# Altium project Peripheral Board.PrjPcb
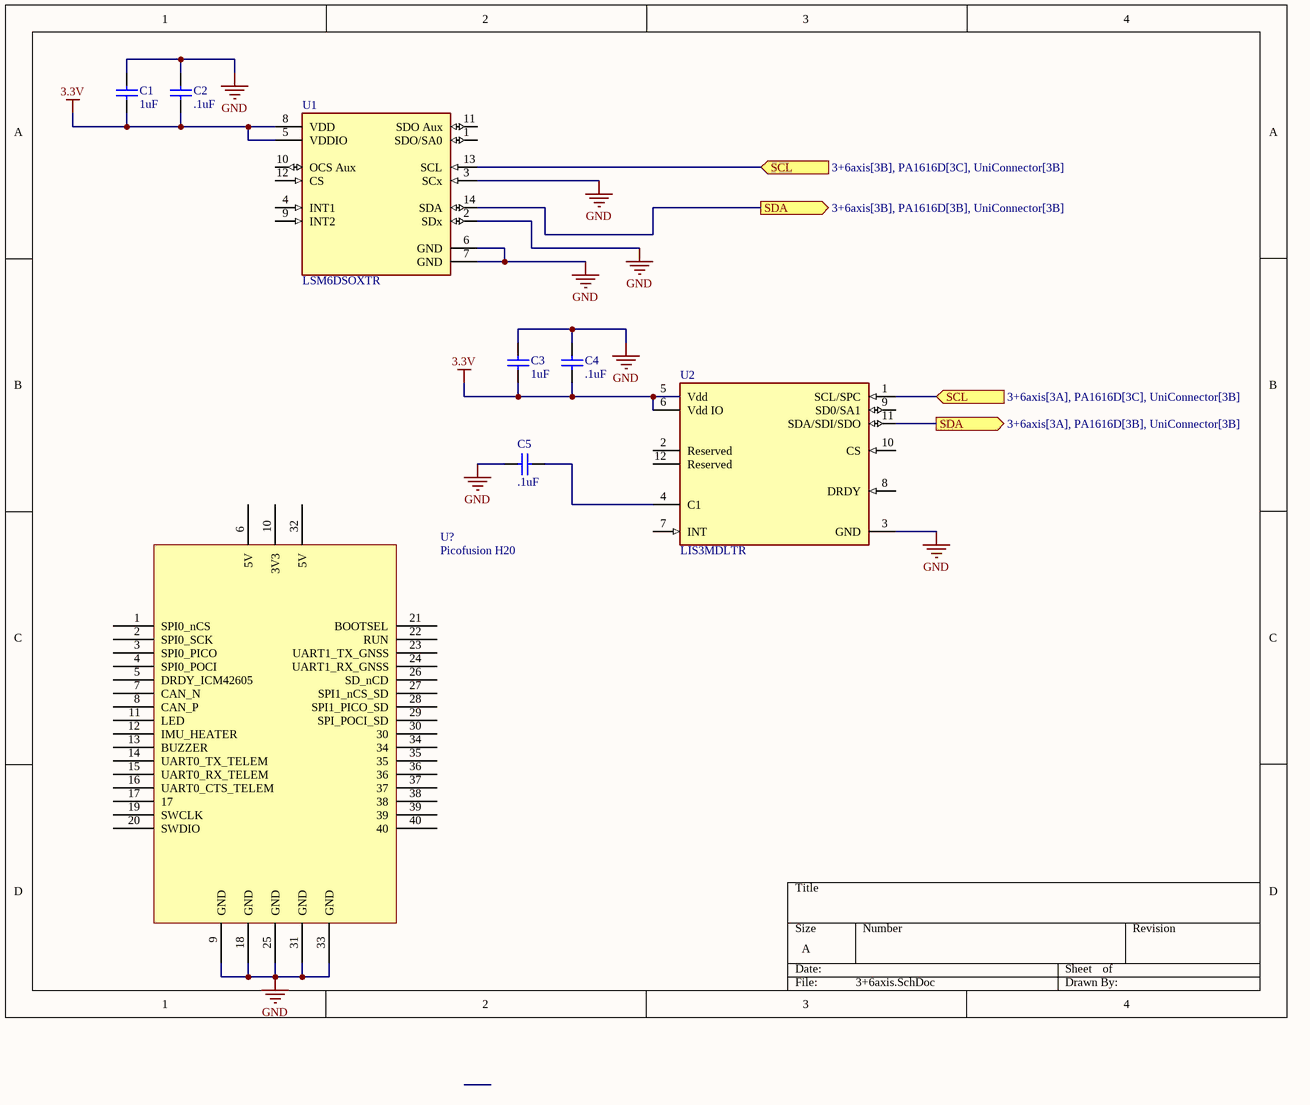
[diagram p0: 3+6axis.SchDoc]
5 sheets, 20 parts. Net scope: flat (ports and power ports of the same name join across sheets).
Board file: Peripheralboard2.PcbDoc
Sheets:
  3+6axis.SchDoc
  CurrentSensor.SchDoc
  Amplifier.SchDoc
  PA1616D.SchDoc
  UniConnector.SchDoc

## Sheet 3+6axis.SchDoc
size A; SheetNumber: 1; SheetTotal: 5

### Parts
C1  1uF  [CAPC2013X145X48ML20T23]
C2  .1uF  [CAPC2013X145X48ML20T23]
C3  1uF  [CAPC2013X145X48ML20T23]
C4  .1uF  [CAPC2013X145X48ML20T23]
C5  .1uF  [CAPC2013X145X48ML20T23]
U1  LSM6DSOXTR  [FP-LGA-14L-DM00249496-MFG]
U2  LIS3MDLTR  [FP-VFLGA-12-8365767-MFG]
U?  Picofusion H20  [PicoFusion H Series]

### Ports
SCL (in, see 3+6axis[3A], PA1616D[3C], UniConnector[3B]), SCL (in, see 3+6axis[3B], PA1616D[3C], UniConnector[3B]), SDA (out, see 3+6axis[3A], PA1616D[3B], UniConnector[3B]), SDA (out, see 3+6axis[3B], PA1616D[3B], UniConnector[3B])

### Nets
3.3V: C1.1 C2.1 C3.1 C4.1 U1.5(VDDIO) U1.8(VDD) U2.5(Vdd) U2.6(Vdd_IO)
GND: C1.2 C2.2 C3.2 C4.2 C5.1 U1.2(SDx) U1.3(SCx) U1.6(GND) U1.7(GND) U2.3(GND) U?.9(GND) U?.18(GND) U?.25(GND) U?.31(GND) U?.33(GND)
NetC5_2: C5.2 U2.4(C1)
NetJ1_D1: U1.14(SDA) U2.11(SDA/SDI/SDO) ; port SDA
NetJ1_D2: U1.13(SCL) U2.1(SCL/SPC) ; port SCL

Not connected (* = marked no-connect by the designer): U1 1(SDO/SA0) 4(INT1) 9(INT2) 10(OCS_Aux) 11(SDO_Aux) 12(CS); U2 2(Reserved) 7(INT) 8(DRDY) 9(SD0/SA1) 10(CS) 12(Reserved); U? 1(SPI0_nCS) 2(SPI0_SCK) 3(SPI0_PICO) 4(SPI0_POCI) 5(DRDY_ICM42605) 6(5V) 7(CAN_N) 8(CAN_P) 10(3V3) 11(LED) 12(IMU_HEATER) 13(BUZZER) 14(UART0_TX_TELEM) 15(UART0_RX_TELEM) 16(UART0_CTS_TELEM) 17 19(SWCLK) 20(SWDIO) 21(BOOTSEL) 22(RUN) 23(UART1_TX_GNSS) 24(UART1_RX_GNSS) 26(SD_nCD) 27(SPI1_nCS_SD) 28(SPI1_PICO_SD) 29(SPI_POCI_SD) 30 32(5V) 34 35 36 37 38 39 40

### Library data of the parts
C1-C5 = CMP-2007-03160-1: Part Number: VJ0805Y103KXBBC31; Manufacturer: Vitramon
U1 = CMP-12177-000010-1: INEMO INERTIAL MODULE: 3D ACCELE; Manufacturer: STMicroelectronics; Sensor Type: Temperature,Accelerometer,Gyroscope; Accel Range: 2/4/8/16g; Accel Sensitivity: 0.061/0.122/0.244/0.488mV/g; Operating Supply Current: 0.55mA; Gyro Range: 125/250/500/1000/2000°/s; Gyro Sensitivity: 4.375/8.75/17.5/35/70LSB/°/s; Sensor Output: I2C,SPI,Other; Min Supply Voltage: 1.62V; Max Supply Voltage: 3.6V; Octopart: https://octopart.com/lsm6dsoxtr-stmicroelectronics-98102600; Package: LGA-14L-DM00249496; Footprint Url: https://www.st.com/content/ccc/resource/technical/document/technical_note/73/17/9c/16/dd/96/4a/01/CD00134799.pdf/files/CD00134799.pdf/jcr:content/translations/en.CD00134799.pdf; ComponentLink2Description: Datasheet; Mouser Description: LSM6DSOX: 3.6 V 3 Axis Accelerometer Gyroscope iNEMO Inertial Module - LGA-14L; ComponentLink2URL: https://www.st.com/resource/en/datasheet/lsm6dsox.pdf; Temperature Range Low: -40°C; Digikey Description: INEMO INERTIAL MODULE: 3D ACCELE; Lead Free: Yes; Device Class L3: Inertial Measurement Units (IMUs); Category: IC; Device Class L2: Motion Sensors; RoHS: TRUE; Temperature: -40°C to +85°C; Height: 0.86mm; Device Class L1: Sensors; Temperature Range High: +85°C; Manufacturer Part Number: LSM6DSOXTR; Automotive: No
U2 = CMP-2000-07463-2: SENSOR MR I2C/SPI 12LGA; Manufacturer: STMicroelectronics; Sensor Output: I2C,SPI; Operating Supply Current: 40-270uA; Max Supply Voltage: 3.6V; Sensing Method: Magnetic; Min Supply Voltage: 1.71V; ComponentLink2URL: https://www.st.com/resource/en/datasheet/lis3mdl.pdf; Category: IC; Manufacturer Part Number: LIS3MDLTR; Octopart: https://octopart.com/lis3mdltr-stmicroelectronics-29403125; Automotive: No; ComponentLink2Description: Datasheet; RoHS: TRUE; Device Class L3: unset; Device Class L1: Sensors; Temperature: -40°C to +85°C; Height: 1mm; Mouser Description: Board Mount Hall Effect / Magnetic Sensors Ultra Lo-Pwr Hi Perf 3-Axis 1.9-3.6V; Temperature Range High: +85°C; Lead Free: Yes; Device Class L2: Magnetic Sensors; Footprint Url: https://www.st.com/content/ccc/resource/technical/document/technical_note/73/17/9c/16/dd/96/4a/01/CD00134799.pdf/files/CD00134799.pdf/jcr:content/translations/en.CD00134799.pdf; Temperature Range Low: -40°C; Package: VFLGA-12-8365767; Digikey Description: SENSOR MR I2C/SPI 12LGA

## Sheet CurrentSensor.SchDoc
size A; SheetNumber: 2; SheetTotal: 5
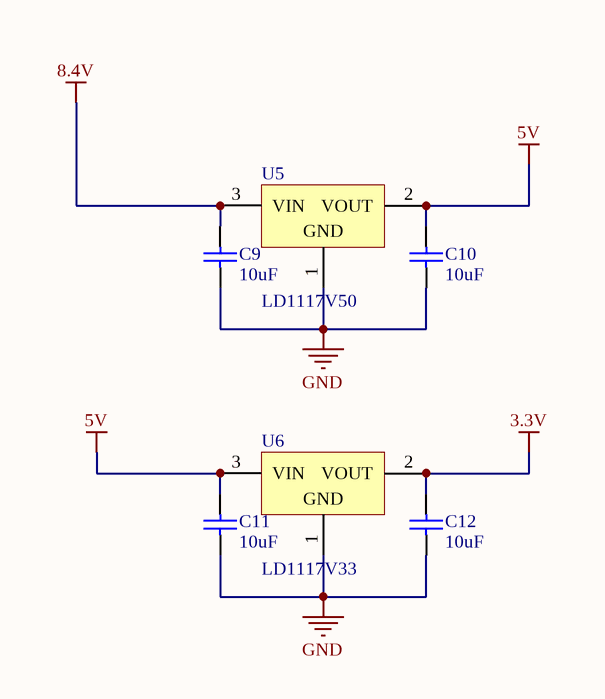
[diagram p1: CurrentSensor.SchDoc]

### Parts
C9  10uF  [CAPC2013X145X48ML20T23]
C10  10uF  [CAPC2013X145X48ML20T23]
C11  10uF  [CAPC2013X145X48ML20T23]
C12  10uF  [CAPC2013X145X48ML20T23]
U5  LD1117V50  [TO220]
U6  LD1117V33  [TO220]

### Nets
3.3V: C12.1 U6.2(VOUT)
5V: C10.1 C11.1 U5.2(VOUT) U6.3(VIN)
8.4V: C9.1 U5.3(VIN)
GND: C9.2 C10.2 C11.2 C12.2 U5.1(GND) U6.1(GND)

### Library data of the parts
C9-C12 = CMP-2007-03160-1: as C1 on sheet 3+6axis
U5 = CMP-0244-00472-1: Fixed Low Drop Positive Voltage Regulator, 5V, 3-Pin TO-220; ComponentLink1URL: http://www.st.com; ComponentLink1Description: Manufacturer URL; DatasheetVersion: 1/11/2011; PackageDescription: TO, Thru-Hole, Vertical, Heatsink Mounted; 3 In-Line Leads; Pitch 2.54 mm; ComponentLink2Description: Datasheet; ComponentLink3URL: http://www.st.com/internet/com/TECHNICAL_RESOURCES/TECHNICAL_LITERATURE/PACKAGE_INFORMATION/CD00004649.pdf; PackageVersion: ver3.0; PackageReference: TO220; ComponentLink2URL: http://www.st.com/internet/com/TECHNICAL_RESOURCES/TECHNICAL_LITERATURE/DATASHEET/CD00000544.pdf; ComponentLink3Description: Package Specification
U6 = CMP-0244-00470-1: Fixed Low Drop Positive Voltage Regulator, 3.3V, 3-Pin TO-220; PackageVersion: ver3.0; PackageDescription: TO, Thru-Hole, Vertical, Heatsink Mounted; 3 In-Line Leads; Pitch 2.54 mm; ComponentLink1Description: Manufacturer URL; ComponentLink3URL: http://www.st.com/internet/com/TECHNICAL_RESOURCES/TECHNICAL_LITERATURE/PACKAGE_INFORMATION/CD00004649.pdf; PackageReference: TO220; ComponentLink2URL: http://www.st.com/internet/com/TECHNICAL_RESOURCES/TECHNICAL_LITERATURE/DATASHEET/CD00000544.pdf; ComponentLink3Description: Package Specification; ComponentLink2Description: Datasheet; ComponentLink1URL: http://www.st.com; DatasheetVersion: 1/11/2011

## Sheet Amplifier.SchDoc
size A; SheetNumber: 3; SheetTotal: 5
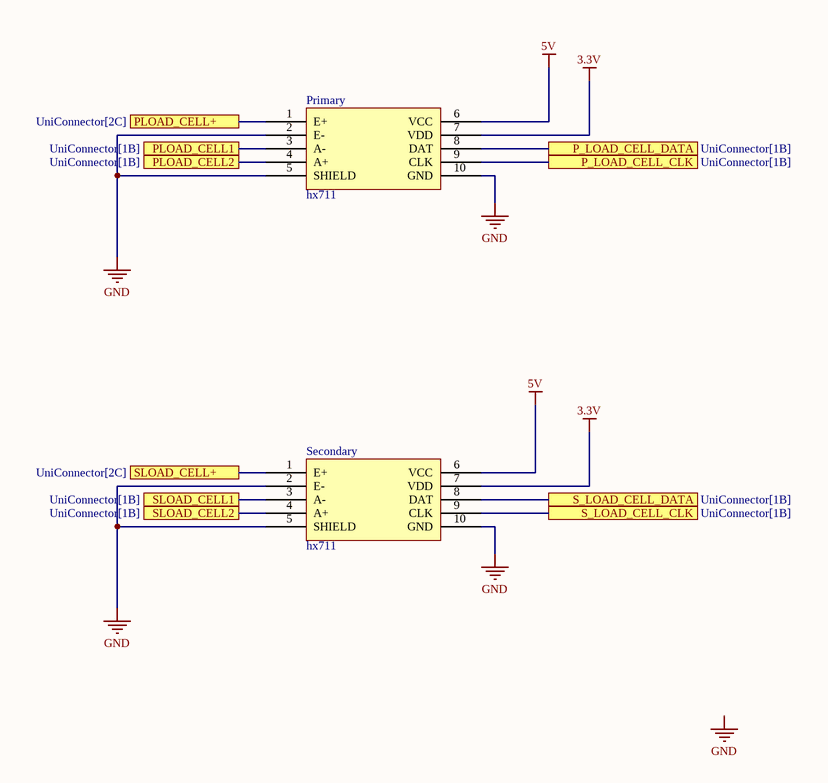
[diagram p2: Amplifier.SchDoc]

### Parts
Primary  hx711  [PCBComponent_1]
Secondary  hx711  [PCBComponent_1]

### Ports
P_LOAD_CELL_CLK (see UniConnector[1B]), P_LOAD_CELL_DATA (see UniConnector[1B]), PLOAD_CELL1 (see UniConnector[1B]), PLOAD_CELL2 (see UniConnector[1B]), PLOAD_CELL+ (see UniConnector[2C]), S_LOAD_CELL_CLK (see UniConnector[1B]), S_LOAD_CELL_DATA (see UniConnector[1B]), SLOAD_CELL1 (see UniConnector[1B]), SLOAD_CELL2 (see UniConnector[1B]), SLOAD_CELL+ (see UniConnector[2C])

### Nets
3.3V: Primary.7(VDD) Secondary.7(VDD)
5V: Primary.6(VCC) Secondary.6(VCC)
GND: Primary.2(E-) Primary.5(SHIELD) Primary.10(GND) Secondary.2(E-) Secondary.5(SHIELD) Secondary.10(GND)
P_LOAD_CELL_CLK: Primary.9(CLK) ; port P_LOAD_CELL_CLK
P_LOAD_CELL_DATA: Primary.8(DAT) ; port P_LOAD_CELL_DATA
S_LOAD_CELL_CLK: Secondary.9(CLK) ; port S_LOAD_CELL_CLK
S_LOAD_CELL_DATA: Secondary.8(DAT) ; port S_LOAD_CELL_DATA
NetJ1_B3: Secondary.3(A-) ; port SLOAD_CELL1
NetJ1_B4: Secondary.4(A+) ; port SLOAD_CELL2
NetJ1_B5: Primary.3(A-) ; port PLOAD_CELL1
NetJ1_B6: Primary.4(A+) ; port PLOAD_CELL2
NetJ1_C4: Primary.1(E+) ; port PLOAD_CELL+
NetJ1_C5: Secondary.1(E+) ; port SLOAD_CELL+

### Notes on the sheet
- Labels drawn without touching a wire or pin: GND

### Library data of the parts
Primary Secondary = Component_1

## Sheet PA1616D.SchDoc
size A; SheetNumber: 4; SheetTotal: 5
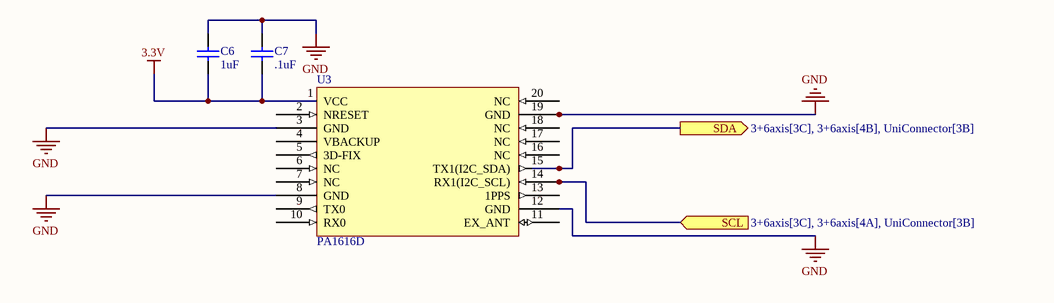
[diagram p3: PA1616D.SchDoc]

### Parts
C6  1uF  [CAPC2013X145X48ML20T23]
C7  .1uF  [CAPC2013X145X48ML20T23]
U3  PA1616D  [PA1616D]

### Ports
SCL (in, see 3+6axis[3C], 3+6axis[4A], UniConnector[3B]), SDA (out, see 3+6axis[3C], 3+6axis[4B], UniConnector[3B])

### Nets
3.3V: C6.1 C7.1 U3.1(VCC)
GND: C6.2 C7.2 U3.3(GND) U3.12(GND) U3.19(GND)
NetJ1_D1: U3.15(TX1(I2C_SDA)) ; port SDA
NetJ1_D2: U3.14(RX1(I2C_SCL)) ; port SCL

Not connected (* = marked no-connect by the designer): U3 2(NRESET) 4(VBACKUP) 5(3D-FIX) 6(NC) 7(NC) 8(GND) 9(TX0) 10(RX0) 11(EX_ANT) 13(1PPS) 16(NC) 17(NC) 18(NC) 20(NC)

### Library data of the parts
C6 C7 = CMP-2007-03160-1: as C1 on sheet 3+6axis

## Sheet UniConnector.SchDoc
size A; SheetNumber: 5; SheetTotal: 5
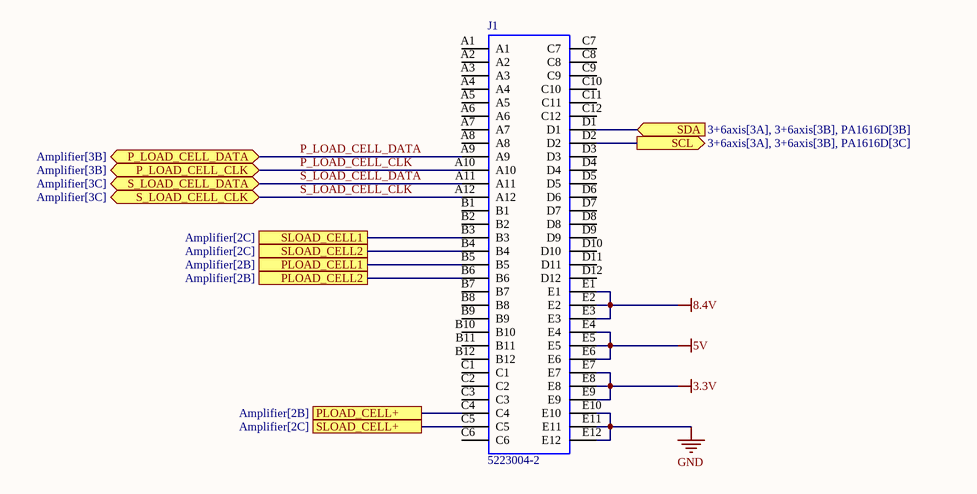
[diagram p4: UniConnector.SchDoc]

### Parts
J1  5223004-2  [52230042]

### Ports
P_LOAD_CELL_CLK (bidir, see Amplifier[3B]), P_LOAD_CELL_DATA (bidir, see Amplifier[3B]), PLOAD_CELL1 (see Amplifier[2B]), PLOAD_CELL2 (see Amplifier[2B]), PLOAD_CELL+ (see Amplifier[2B]), S_LOAD_CELL_CLK (bidir, see Amplifier[3C]), S_LOAD_CELL_DATA (bidir, see Amplifier[3C]), SCL (out, see 3+6axis[3A], 3+6axis[3B], PA1616D[3C]), SDA (in, see 3+6axis[3A], 3+6axis[3B], PA1616D[3B]), SLOAD_CELL1 (see Amplifier[2C]), SLOAD_CELL2 (see Amplifier[2C]), SLOAD_CELL+ (see Amplifier[2C])

### Nets
3.3V: J1.E7 J1.E8 J1.E9
5V: J1.E4 J1.E5 J1.E6
8.4V: J1.E1 J1.E2 J1.E3
GND: J1.E10 J1.E11 J1.E12
P_LOAD_CELL_CLK: J1.A10 ; port P_LOAD_CELL_CLK
P_LOAD_CELL_DATA: J1.A9 ; port P_LOAD_CELL_DATA
S_LOAD_CELL_CLK: J1.A12 ; port S_LOAD_CELL_CLK
S_LOAD_CELL_DATA: J1.A11 ; port S_LOAD_CELL_DATA
NetJ1_B3: J1.B3 ; port SLOAD_CELL1
NetJ1_B4: J1.B4 ; port SLOAD_CELL2
NetJ1_B5: J1.B5 ; port PLOAD_CELL1
NetJ1_B6: J1.B6 ; port PLOAD_CELL2
NetJ1_C4: J1.C4 ; port PLOAD_CELL+
NetJ1_C5: J1.C5 ; port SLOAD_CELL+
NetJ1_D1: J1.D1 ; port SDA
NetJ1_D2: J1.D2 ; port SCL

Not connected (* = marked no-connect by the designer): J1 A1 A2 A3 A4 A5 A6 A7 A8 B1 B2 B7 B8 B9 B10 B11 B12 C1 C2 C3 C6 C7 C8 C9 C10 C11 C12 D3 D4 D5 D6 D7 D8 D9 D10 D11 D12

### Library data of the parts
J1 = 5223004-2: Conn Backplane RCP 60 POS 2mm Solder RA Thru-Hole Tube; Manufacturer_Name: TE Connectivity; Geometry.Height: 14mm; Mouser Part Number: 571-5223004-2; Mouser Price/Stock: https://www.mouser.co.uk/ProductDetail/TE-Connectivity/5223004-2?qs=oNRo%252BTjlpTO6tP0xSX%252BI3w%3D%3D; Manufacturer_Part_Number: 5223004-2; Datasheet Link: https://www.te.com/commerce/DocumentDelivery/DDEController?Action=srchrtrv&DocNm=5223004&DocType=Customer+Drawing&DocLang=English

## Nets that join several sheets
3.3V: 3+6axis (8 pins), CurrentSensor (C12.1 U6.2), Amplifier (Primary.7 Secondary.7), PA1616D (C6.1 C7.1 U3.1), UniConnector (J1.E7 J1.E8 J1.E9)
5V: CurrentSensor (C10.1 C11.1 U5.2 U6.3), Amplifier (Primary.6 Secondary.6), UniConnector (J1.E4 J1.E5 J1.E6)
8.4V: CurrentSensor (C9.1 U5.3), UniConnector (J1.E1 J1.E2 J1.E3)
GND: 3+6axis (15 pins), CurrentSensor (6 pins), Amplifier (6 pins), PA1616D (5 pins), UniConnector (J1.E10 J1.E11 J1.E12)
NetJ1_B3: Amplifier (Secondary.3), UniConnector (J1.B3)
NetJ1_B4: Amplifier (Secondary.4), UniConnector (J1.B4)
NetJ1_B5: Amplifier (Primary.3), UniConnector (J1.B5)
NetJ1_B6: Amplifier (Primary.4), UniConnector (J1.B6)
NetJ1_C4: Amplifier (Primary.1), UniConnector (J1.C4)
NetJ1_C5: Amplifier (Secondary.1), UniConnector (J1.C5)
NetJ1_D1: 3+6axis (U1.14 U2.11), PA1616D (U3.15), UniConnector (J1.D1)
NetJ1_D2: 3+6axis (U1.13 U2.1), PA1616D (U3.14), UniConnector (J1.D2)
P_LOAD_CELL_CLK: Amplifier (Primary.9), UniConnector (J1.A10)
P_LOAD_CELL_DATA: Amplifier (Primary.8), UniConnector (J1.A9)
S_LOAD_CELL_CLK: Amplifier (Secondary.9), UniConnector (J1.A12)
S_LOAD_CELL_DATA: Amplifier (Secondary.8), UniConnector (J1.A11)